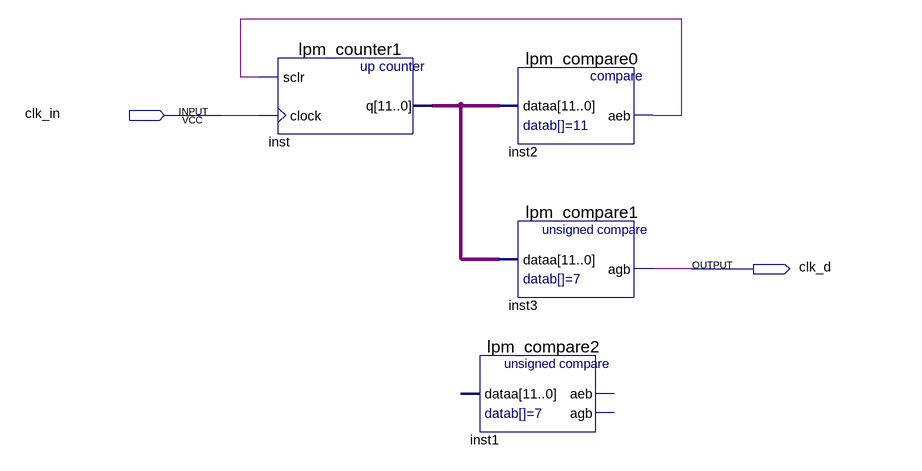
[diagram p0: schematic sheet]
// Quartus schematic block2.bdf as structural Verilog: 4 symbols, 2 pins
module block2 (
  input  clk_in,
  output clk_d
);

  wire inst2_aeb;
  wire [11:0] inst_q;

  lpm_counter1 inst (.sclr(inst2_aeb), .clock(clk_in), .q(inst_q));
  lpm_compare2 inst1 ();  // open: dataa, aeb, agb
  lpm_compare0 inst2 (.dataa(inst_q), .aeb(inst2_aeb));
  lpm_compare1 inst3 (.dataa(inst_q), .agb(clk_d));
endmodule
